# EAGLE schematic Roomsensor V2 (EAGLE 7.5.0)
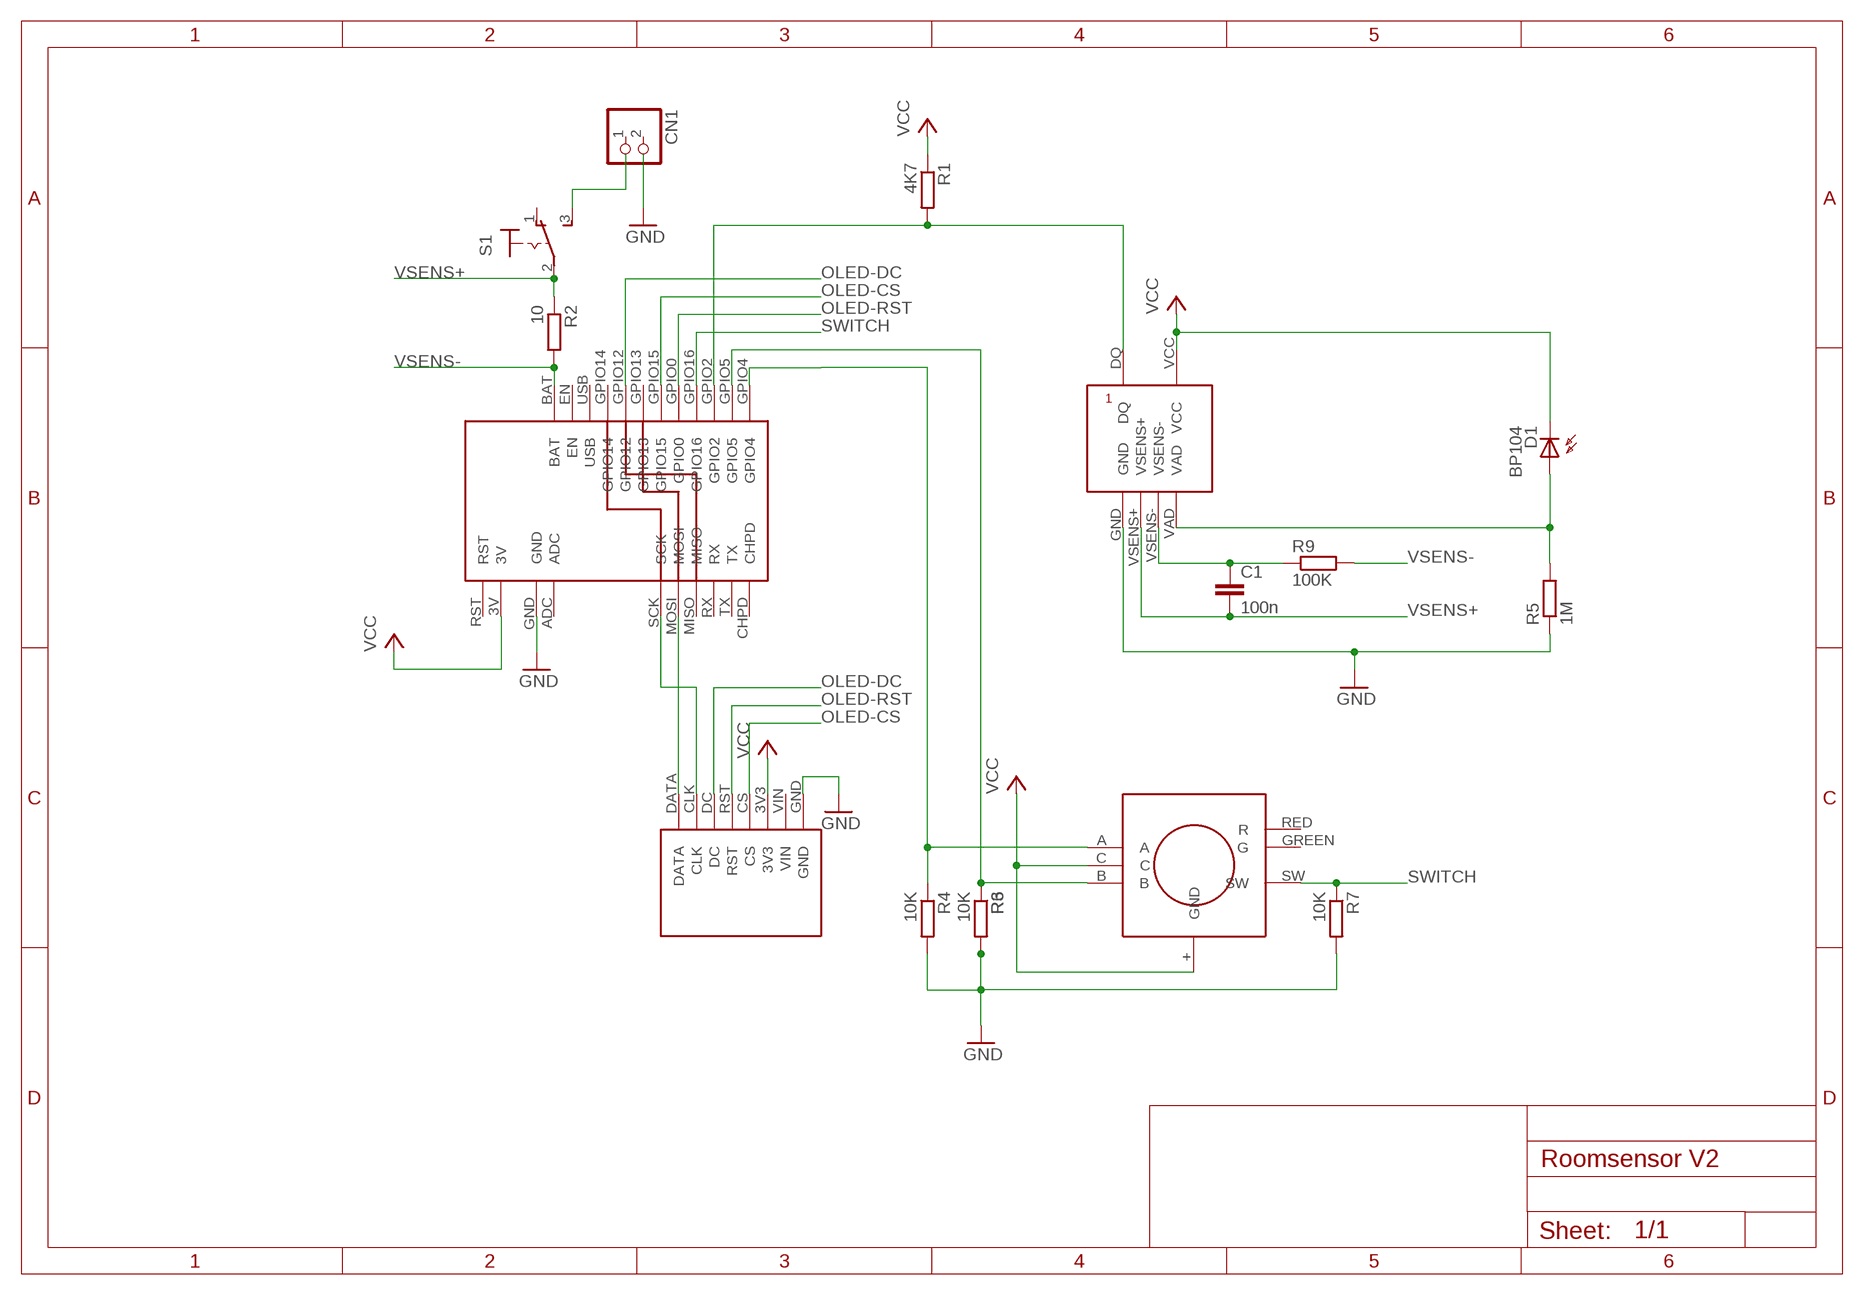
[diagram p0: schematic, sheet 1]

## Parts
C1  100n  C5/2.5  [C5B2.5]
CN1  JST_2PIN-THM  [JST-PH-2-THM]
D1  BP104  [BP104]
R1  4K7  R-EU_0204/7  [0204/7]
R2  10  R-EU_0204/7  [0204/7]
R3  R-EU_0204/7  [0204/7]
R4  10K  R-EU_0204/7  [0204/7]
R5  1M  R-EU_0204/7  [0204/7]
R6  10K  R-EU_0204/7  [0204/7]
R7  10K  R-EU_0204/7  [0204/7]
R9  100K  R-EU_0204/7  [0204/7]
S1  M9040P  [M9040P]
U$1  DS2438-ADAPTOR  [DS2438-ADAPTOR]
U$2  HUZZAH-ESP8266  [HUZZAH-ESP8266]
U$3  OLED  [OLED-SPI]
U$4  ROTARY-ENCODER-RG  [ROTARY-ENCODER-RG]

## Nets
GND: R3.2 R4.2 R5.1 R6.2 R7.2 U$1.GND U$2.GND U$3.GND
N$5: R1.2 U$1.DQ U$2.GPIO2
N$6: S1.3(S)
OLED-CS: U$2.GPIO15 U$3.CS
OLED-DC: U$2.GPIO12 U$3.DC
OLED-MOSI: U$2.MOSI U$3.DATA
OLED-RST: U$2.GPIO0 U$3.RST
OLED-SCK: U$2.SCK U$3.CLK
PHASE-A: R3.1 R6.1 U$2.GPIO5 U$4.B
PHASE-B: R4.1 U$2.GPIO4 U$4.A
SWITCH: R7.1 U$2.GPIO16 U$4.SW
VAD: R5.2 U$1.VAD
VCC: D1.K(C) R1.1 U$1.VCC U$2.3V U$3.3V3 U$4.+(GND) U$4.C
VSENS+: R2.1 S1.2(P)
VSENS-: C1.1 C1.2 R2.2 R9.1 R9.2 U$1.VSENS+ U$1.VSENS- U$2.BAT
Unconnected: CN1.1 CN1.2 D1.A S1.1(O) U$2.ADC U$2.CHPD U$2.EN U$2.GPIO13 U$2.GPIO14 U$2.MISO U$2.RST U$2.RX U$2.TX U$2.USB U$3.VIN U$4.GREEN(G) U$4.RED(R)

## Library data of the parts
C1 = capacitor-wima:C: CAPACITOR naming: grid - package width
CN1 = adafruit:JST_2PIN: JST 2-Pin Connectors of various flavors SMT-RA (S2B-PH-SM4) 4UConnector #17311 SMT (B2B-PH-SM4) THM-RA (S2B-PH) THM (B2B-PH)
D1 = opto-trans-siemens:BP104: PHOTO DIODE; MF: VISHAY/TELEFUNKEN; MPN: BP104; OC_FARNELL: 1779636; OC_NEWARK: 14M4504
R1-R7 R9 = resistor:R-EU_: RESISTOR, European symbol
S1 = switch:M9040P: TOGGLE SWITCH Marquardt
U$1 = resterampeberlin:DS2438-ADAPTOR
U$2 = resterampeberlin:HUZZAH-ESP8266
U$3 = resterampeberlin:OLED
U$4 = resterampeberlin:ROTARY-ENCODER-RG